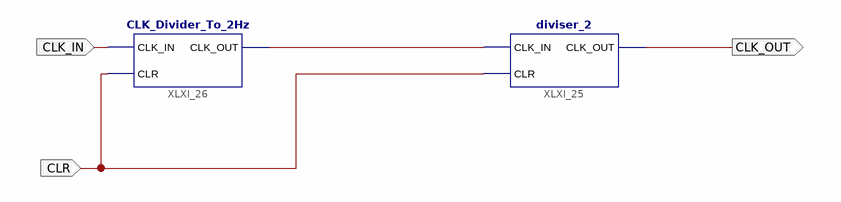
[diagram p0: schematic sheet 1]
// Xilinx ISE schematic CLK_Divider_To_1Hz.sch (spartan6) as structural Verilog: 2 symbols, 3 ports
module CLK_Divider_To_1Hz (
  input  CLK_IN,
  input  CLR,
  output CLK_OUT
);

  wire XLXN_11;

  diviser_2 XLXI_25 (.CLK_IN(XLXN_11), .CLK_OUT(CLK_OUT), .CLR(CLR));
  CLK_Divider_To_2Hz XLXI_26 (.CLK_IN(CLK_IN), .CLK_OUT(XLXN_11), .CLR(CLR));
endmodule
